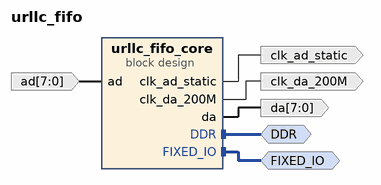
[diagram p0: block diagram of the top level]
# Vivado block design urllc_fifo, xc7z020clg400-2, Vivado 2021.1
create_bd_design urllc_fifo

create_bd_intf_port -mode Master -vlnv xilinx.com:interface:ddrx_rtl:1.0 DDR
create_bd_intf_port -mode Master -vlnv xilinx.com:display_processing_system7:fixedio_rtl:1.0 FIXED_IO
create_bd_port -dir I -from 7 -to 0 -type data ad
create_bd_port -dir O -from 7 -to 0 -type data da
create_bd_port -dir O -type clk clk_ad_static
create_bd_port -dir O -type clk clk_da_200M

create_bd_cell -type container -reference urllc_fifo_core urllc_fifo_core
set_property -dict [list \
  CONFIG.ACTIVE_SIM_BD urllc_fifo_core.bd \
  CONFIG.ACTIVE_SYNTH_BD urllc_fifo_core.bd \
  CONFIG.ENABLE_DFX 0 \
  CONFIG.LIST_SIM_BD urllc_fifo_core.bd \
  CONFIG.LIST_SYNTH_BD urllc_fifo_core.bd \
  CONFIG.LOCK_PROPAGATE 0 \
] [get_bd_cells urllc_fifo_core]

# ---- connections ----

connect_bd_intf_net -intf_net processing_system7_0_DDR [get_bd_intf_ports DDR] [get_bd_intf_pins urllc_fifo_core/DDR]
connect_bd_intf_net -intf_net processing_system7_0_FIXED_IO [get_bd_intf_ports FIXED_IO] [get_bd_intf_pins urllc_fifo_core/FIXED_IO]
connect_bd_net [get_bd_ports ad] [get_bd_pins urllc_fifo_core/ad]
connect_bd_net -net clk_dynamic_clk_out_200M [get_bd_pins urllc_fifo_core/clk_da_200M] [get_bd_ports clk_da_200M]
connect_bd_net -net clk_wiz_0_clk_out1 [get_bd_pins urllc_fifo_core/clk_ad_static] [get_bd_ports clk_ad_static]
connect_bd_net -net mux_0_data_out [get_bd_pins urllc_fifo_core/da] [get_bd_ports da]

# ---- address map ----
assign_bd_address -offset 0x00000000 -range 256M -target_address_space [get_bd_addr_spaces urllc_fifo_core/core/axi_dma_0/Data_MM2S] [get_bd_addr_segs urllc_fifo_core/core/processing_system7_0/S_AXI_HP0/HP0_DDR_LOWOCM]
assign_bd_address -offset 0x10000000 -range 256M -target_address_space [get_bd_addr_spaces urllc_fifo_core/core/axi_dma_0/Data_MM2S] [get_bd_addr_segs urllc_fifo_core/core/processing_system7_0/S_AXI_HP1/HP1_DDR_LOWOCM]
assign_bd_address -offset 0x00000000 -range 256M -target_address_space [get_bd_addr_spaces urllc_fifo_core/core/axi_dma_0/Data_S2MM] [get_bd_addr_segs urllc_fifo_core/core/processing_system7_0/S_AXI_HP0/HP0_DDR_LOWOCM]
assign_bd_address -offset 0x10000000 -range 256M -target_address_space [get_bd_addr_spaces urllc_fifo_core/core/axi_dma_0/Data_S2MM] [get_bd_addr_segs urllc_fifo_core/core/processing_system7_0/S_AXI_HP1/HP1_DDR_LOWOCM]
assign_bd_address -offset 0x40400000 -range 64K -target_address_space [get_bd_addr_spaces urllc_fifo_core/core/processing_system7_0/Data] [get_bd_addr_segs urllc_fifo_core/core/axi_dma_0/S_AXI_LITE/Reg]
assign_bd_address -offset 0x41200000 -range 64K -target_address_space [get_bd_addr_spaces urllc_fifo_core/core/processing_system7_0/Data] [get_bd_addr_segs urllc_fifo_core/debug_ctrl/axi_gpio_0/S_AXI/Reg]

validate_bd_design
save_bd_design
